# Altium schematic sheet 12V_IdealDiode_PowerSupply_v1.SchDoc
size A; SheetNumber: 1; SheetTotal: 2
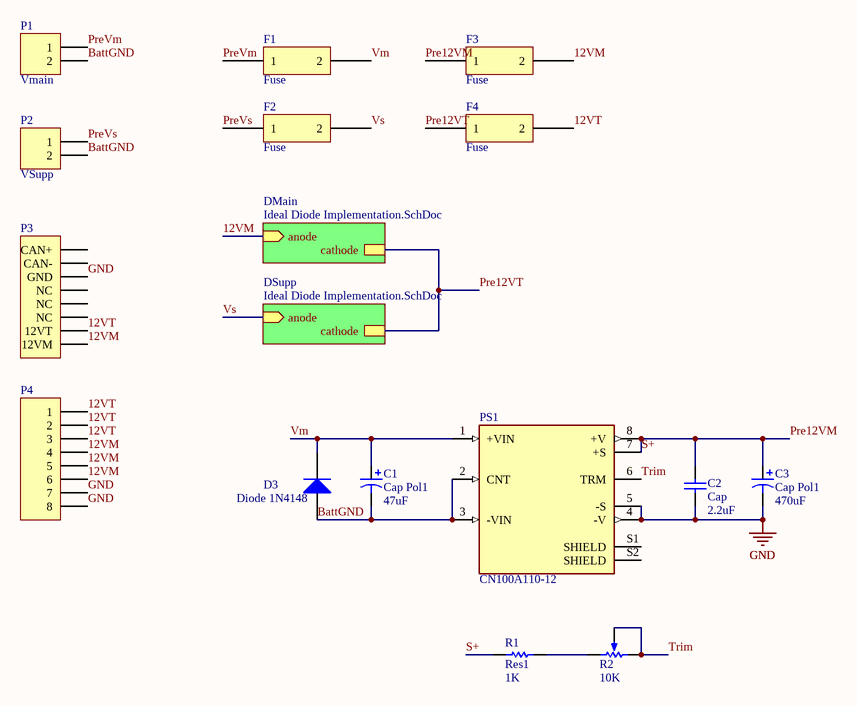
[diagram p0: 12V_IdealDiode_PowerSupply_v1.SchDoc]

## Parts
C1  Cap Pol1  value 47uF  [RB7.6-15]
C2  Cap  value 2.2uF  [RAD-0.3]
C3  Cap Pol1  value 470uF  [RB7.6-15]
D3  Diode 1N4148  [DO-35]
F1  Fuse  [Fuse Hilder]
F2  Fuse  [Fuse Hilder]
F3  Fuse  [Fuse Hilder]
F4  Fuse  [Fuse Hilder]
P1  Vmain  [HDR1X2H]
P2  VSupp  [HDR1X2H]
P3  Header 8  [HDR1X8]  (value not drawn)
P4  Header 8  [HDR1X8]  (value not drawn)
PS1  CN100A110-12  [CONV_CN100A110-12]
R1  Res1  value 1K  [AXIAL-0.3]
R2  value 10K  [POT OFFSET 100_1]  (hidden comment: RPot_2)

## Sub-sheets
DMain = Ideal Diode Implementation.SchDoc: anode (in), cathode
DSupp = Ideal Diode Implementation.SchDoc: anode (in), cathode

## Nets
GND: C2.1 C3.2 P3.3(GND) P4.7 P4.8 PS1.4(-V) PS1.5(-S)
12VM: F3.2 P3.8(12VM) P4.4 P4.5 P4.6 ; sheet DMain/anode
12VT: F4.2 P3.7(12VT) P4.1 P4.2 P4.3
BattGND: C1.2 D3.1(A) P1.2 P2.2 PS1.2(CNT) PS1.3(-VIN)
Pre12VM: C2.2 C3.1 F3.1 PS1.7(+S) PS1.8(+V) R1.1  [also labelled S+]
Pre12VT: F4.1 ; sheet DMain/cathode, sheet DSupp/cathode
PreVm: F1.1 P1.1
PreVs: F2.1 P2.1
Trim: PS1.6(TRM) R2.1(TOP) R2.2(TAP)
Vm: C1.1 D3.2(K) F1.2 PS1.1(+VIN)
Vs: F2.2 ; sheet DSupp/anode
NetR1_2: R1.2 R2.3(BOT)

Not connected (* = marked no-connect by the designer): P3 1(CAN+) 2(CAN-) 4(NC) 5(NC) 6(NC); PS1 S1(SHIELD) S2(SHIELD)

## Library data of the parts
C1 C3 = Cap Pol1: Polarized Capacitor (Radial); Published: 8-Jun-2000; LatestRevisionDate: 17-Jul-2002; LatestRevisionNote: Re-released for DXP Platform.; PackageReference: RB7.6-15; Publisher: Altium Limited; PackageDescription: Polarized Capacitor (Radial); 2 Leads
C2 = Cap: Ceramic Capacitor; Published: 8-Jun-2000; LatestRevisionDate: 17-Jul-2002; LatestRevisionNote: Re-released for DXP Platform.; PackageReference: RAD-0.3; Publisher: Altium Limited; PackageDescription: Radial Cap, Thru-Hole; 2 Leads; 0.3 in Pin Spacing
D3 = Diode 1N4148: High Conductance Fast Diode; Published: 8-Jun-2000; LatestRevisionDate: 17-Jul-2002; LatestRevisionNote: Re-released for DXP Platform.; DatasheetVersion: 1997; PackageReference: DO-35; Publisher: Altium Limited; PackageDescription: Diode, Axial; Body 3.8 x 1.9 mm (LxDia. max), Lead Dia. 0.53 mm (max); Code_JEDEC: DO-204-AH; ComponentLink1Description: Manufacturer Link; ComponentLink1URL: http://www.fairchildsemi.com/; ComponentLink2Description: Datasheet; ComponentLink2URL: http://www.fairchildsemi.com/ds/1N%2F1N4148.pdf
P1 P2 = Header 2H: Header, 2-Pin, Right Angle; LatestRevisionDate: 17-Jul-2002; LatestRevisionNote: Re-released for DXP Platform.; Publisher: Altium Limited
P3 P4 = Header 8: Header, 8-Pin; LatestRevisionDate: 17-Jul-2002; LatestRevisionNote: Re-released for DXP Platform.; Publisher: Altium Limited
PS1 = CN100A110-12: Isolated Module DC DC Converter 1 Output 12V - - 8.4A 60V - 160V Input; MF: TDK-Lambda Americas Inc; Price: None; Availability: In Stock; Check_prices: https://www.snapeda.com/parts/CN100A110-12/TDK-Lambda+Americas+Inc/view-part/?ref=eda; Value: *; MP: CN100A110-12; Package: DIP-9 TDK-Lambda Americas Inc; Purchase-URL: https://pricing.snapeda.com/search/part/CN100A110-12/?ref=eda; SnapEDA_Link: https://www.snapeda.com/parts/CN100A110-12/TDK-Lambda+Americas+Inc/view-part/?ref=snap
R1 = Res1: Resistor; Published: 8-Jun-2000; LatestRevisionDate: 17-Jul-2002; LatestRevisionNote: Re-released for DXP Platform.; PackageReference: AXIAL-0.3; Publisher: Altium Limited; PackageDescription: Axial Device, Thru-Hole; 2 Leads; 0.3 in Pin Spacing
R2 = RPot_5: Potentiometer; Sim Note: Enter the Resistance value and the set point into parameter fields.; Set Position: 0.5; Published: 8-Jun-2000; LatestRevisionDate: 17-Jul-2002; LatestRevisionNote: Re-released for DXP Platform.; PackageReference: VR5; Publisher: Altium Limited; PackageDescription: Variable Resistor, Thru-Hole; 3 Leads